# EAGLE schematic m2201-stereo-input (EAGLE 7.5.0)
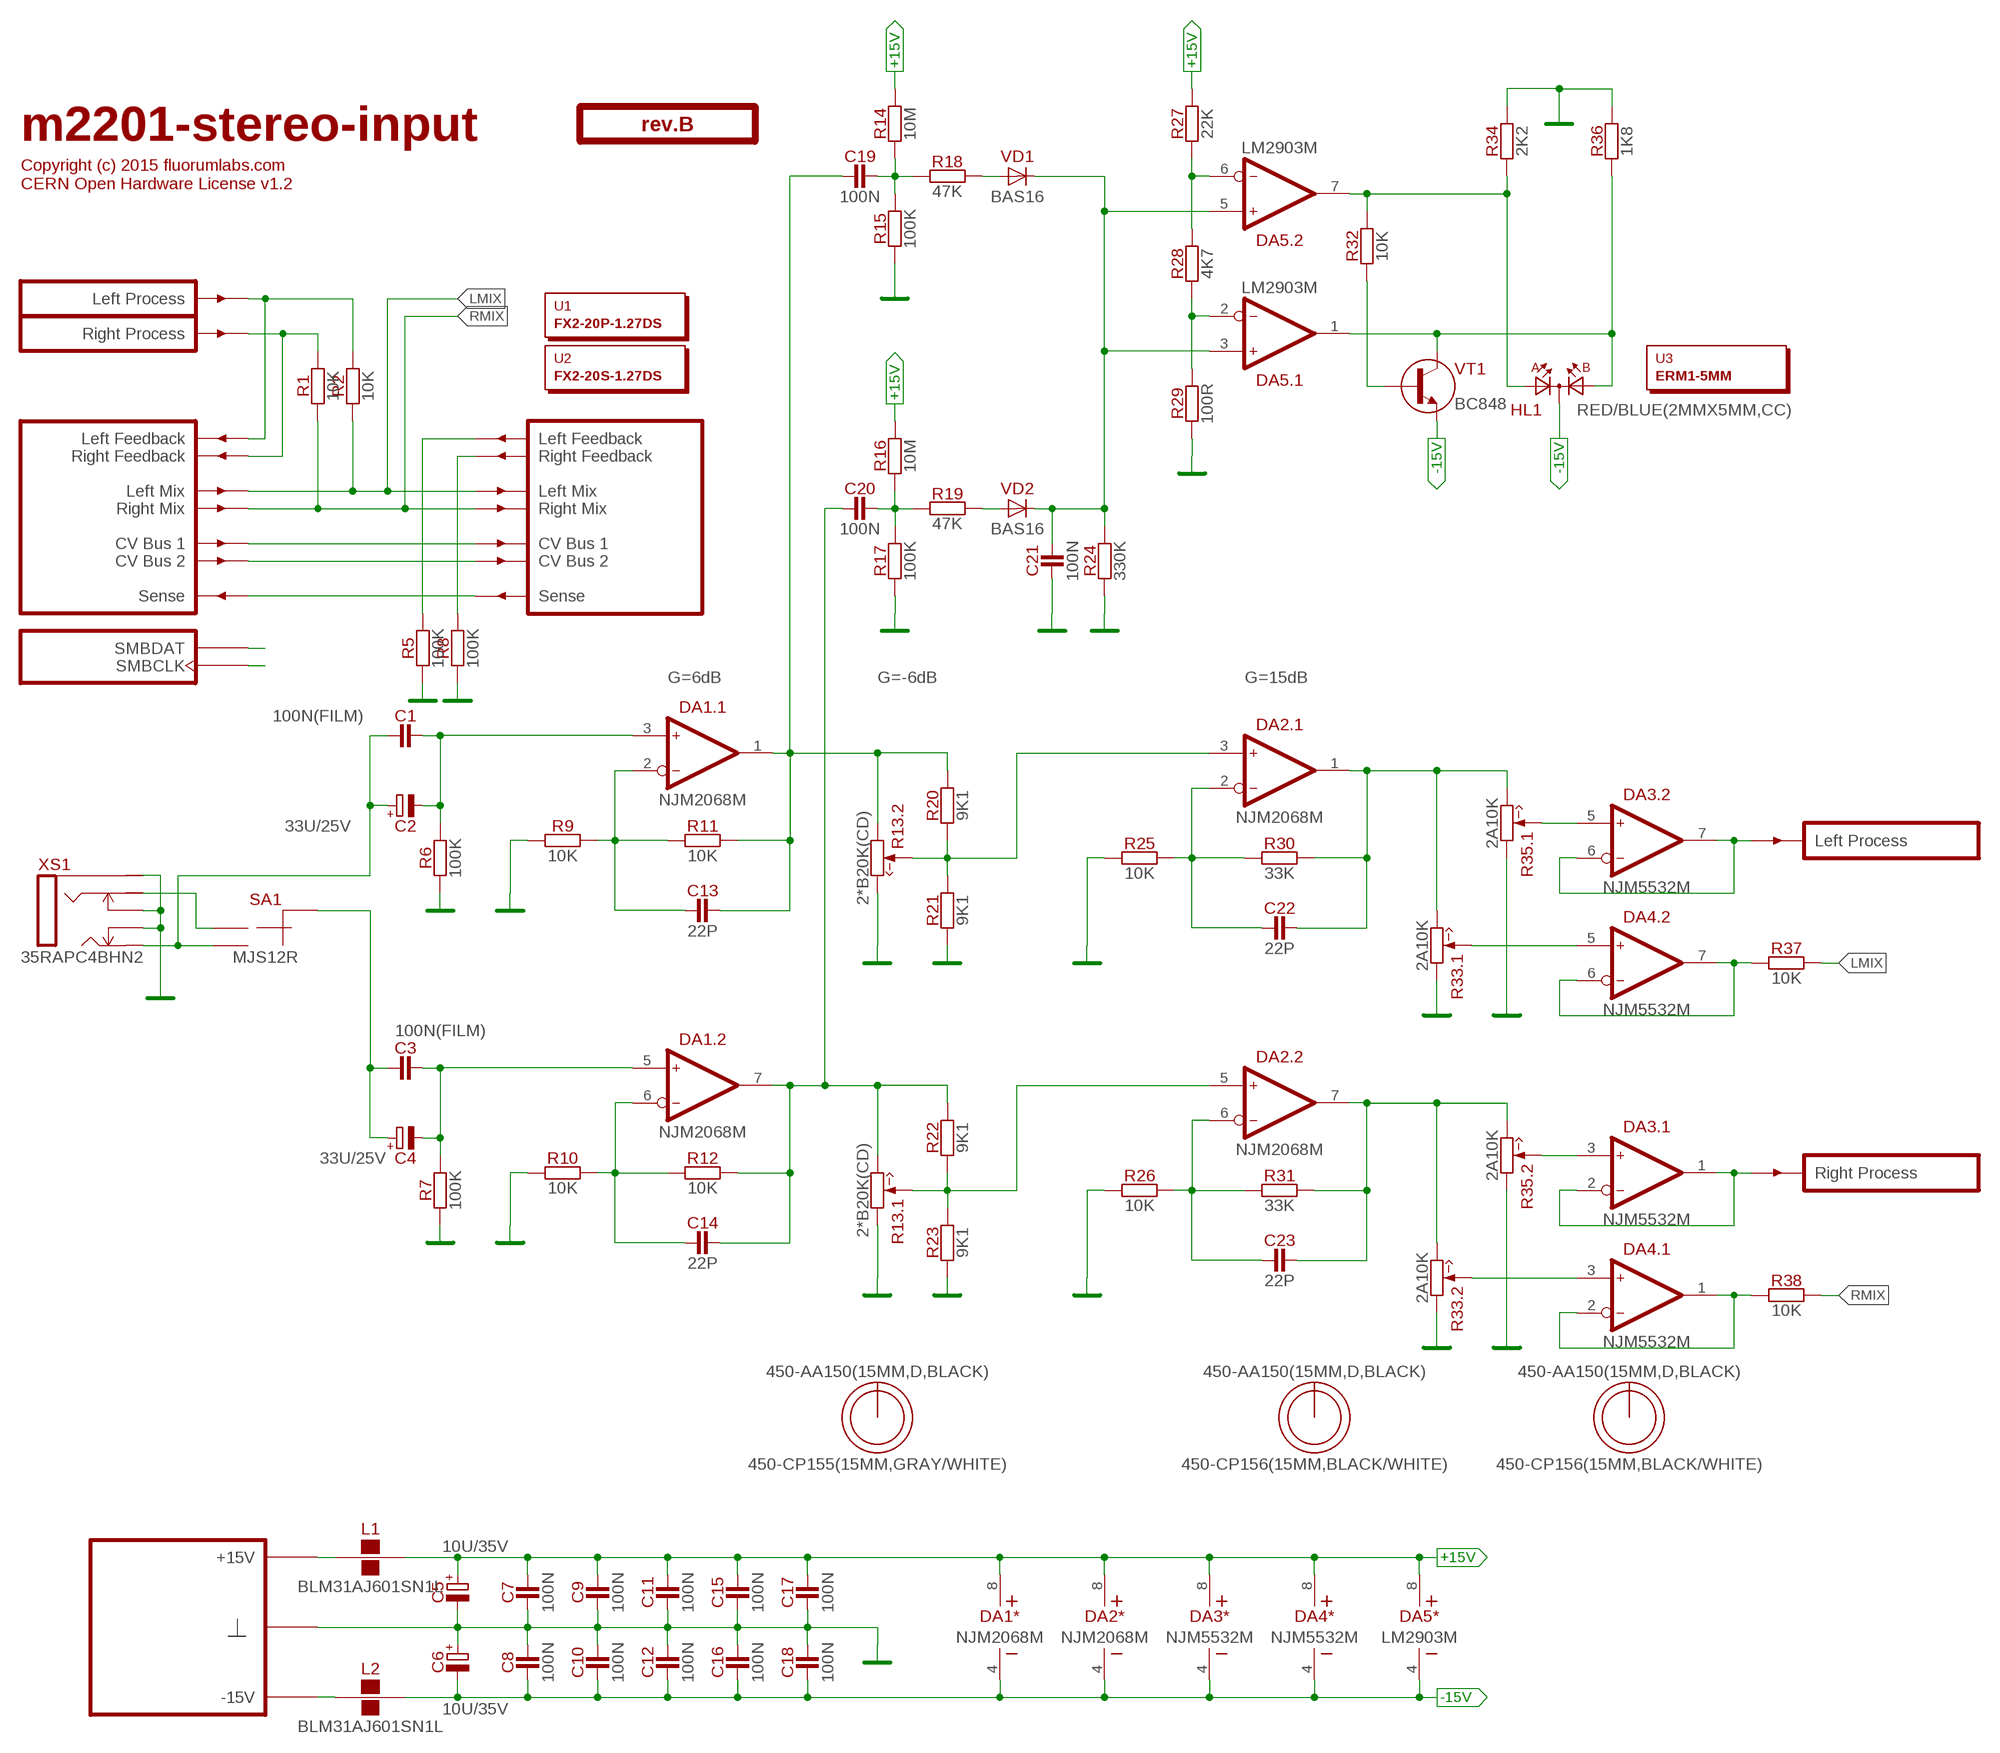
[diagram p0: schematic, sheet 1]

## Parts
C1  100N(FILM)  [C050-025X075]
C2  33U/25V  [E2,5-7]
C3  100N(FILM)  [C050-025X075]
C4  33U/25V  [E2,5-7]
C5  10U/35V  [E2-5]
C6  10U/35V  [E2-5]
C7  100N  [C-0805]
C8  100N  [C-0805]
C9  100N  [C-0805]
C10  100N  [C-0805]
C11  100N  [C-0805]
C12  100N  [C-0805]
C13  22P  [C-0805]
C14  22P  [C-0805]
C15  100N  [C-0805]
C16  100N  [C-0805]
C17  100N  [C-0805]
C18  100N  [C-0805]
C19  100N  [C-0805]
C20  100N  [C-0805]
C21  100N  [C-0805]
C22  22P  [C-0805]
C23  22P  [C-0805]
DA1  NJM2068M  [SO-8]
DA2  NJM2068M  [SO-8]
DA3  NJM5532M  [SO-8]
DA4  NJM5532M  [SO-8]
DA5  LM2903M  [SO-8]
HL1  RED/BLUE(2MMX5MM,CC)  [LED2X5-3PIN]
L1  BLM31AJ601SN1L  [1206]
L2  BLM31AJ601SN1L  [1206]
O1  TITLE  [EMPTY]
O2  450-AA150(15MM,D,BLACK)  [EMPTY]
O3  450-CP155(15MM,GRAY/WHITE)  [EMPTY]
O4  450-AA150(15MM,D,BLACK)  [EMPTY]
O5  450-CP156(15MM,BLACK/WHITE)  [EMPTY]
O6  450-AA150(15MM,D,BLACK)  [EMPTY]
O7  450-CP156(15MM,BLACK/WHITE)  [EMPTY]
PCB1  rev.B  ST2-BOARD-50  [ST2-BOARD-50]
R1  10K  [R-0805]
R2  10K  [R-0805]
R5  100K  [R-0805]
R6  100K  [R-0805]
R7  100K  [R-0805]
R8  100K  [R-0805]
R9  10K  [R-0805]
R10  10K  [R-0805]
R11  10K  [R-0805]
R12  10K  [R-0805]
R13  2*B20K(CD)  2B20K(CD)  [RV11-DUAL]
R14  10M  [R-0805]
R15  100K  [R-0805]
R16  10M  [R-0805]
R17  100K  [R-0805]
R18  47K  [R-0805]
R19  47K  [R-0805]
R20  9K1  [R-0805]
R21  9K1  [R-0805]
R22  9K1  [R-0805]
R23  9K1  [R-0805]
R24  330K  [R-0805]
R25  10K  [R-0805]
R26  10K  [R-0805]
R27  22K  [R-0805]
R28  4K7  [R-0805]
R29  100R  [R-0805]
R30  33K  [R-0805]
R31  33K  [R-0805]
R32  10K  [R-0805]
R33  2A10K  [RV11-DUAL]
R34  2K2  [R-0805]
R35  2A10K  [RV11-DUAL]
R36  1K8  [R-0805]
R37  10K  [R-0805]
R38  10K  [R-0805]
SA1  MJS12R  [APEM-MJS12R]
U1  FX2-20P-1.27DS  [EMPTY]
U2  FX2-20S-1.27DS  [EMPTY]
U3  ERM1-5MM  [EMPTY]
VD1  BAS16  [SOT23]
VD2  BAS16  [SOT23]
VT1  BC848  [SOT23]
XS1  35RAPC4BHN2  [35RAP]

## Nets
+15V [power]: C5.+ C7.2 C9.2 C11.2 C15.2 C17.2 DA1.8(*:V+) DA2.8(*:V+) DA3.8(*:V+) DA4.8(*:V+) DA5.8(*:V+) L1.2 R14.2 R16.2 R27.2
-15V: C6.- C8.1 C10.1 C12.1 C16.1 C18.1 DA1.4(*:V-) DA2.4(*:V-) DA3.4(*:V-) DA4.4(*:V-) DA5.4(*:V-) HL1.K L2.2 VT1.2(E)
GND: C5.- C6.+ C7.1 C8.2 C9.1 C10.2 C11.1 C12.2 C15.1 C16.2 C17.1 C18.2 C21.1 PCB1.B4'(GND) PCB1.B4(GND) PCB1.B5'(GND) PCB1.B5(GND) PCB1.B6'(GND) PCB1.B6(GND) PCB1.B7'(GND) PCB1.B7(GND) PCB1.B8'(GND) PCB1.B8(GND) R5.1 R6.1 R7.1 R8.1 R9.1 R10.1 R13.1(.1:CCW) R13.3'(.2:CW) R15.1 R17.1 R21.1 R23.1 R24.1 R25.1 R26.1 R29.1 R33.1'(.2:CCW) R33.1(.1:CCW) R34.2 R35.1'(.2:CCW) R35.1(.1:CCW) R36.2 XS1.1(S) XS1.10(TN) XS1.11(RN)
LMIX: PCB1.ALMIX'(LMIX') PCB1.ALMIX(LMIX) R2.1 R37.2
N$1: L1.1 PCB1.A+15'(P+15V) PCB1.A+15(P+15V) PCB1.B+15'(P+15V) PCB1.B+15(P+15V)
N$2: PCB1.ARFBK'(RFBK') R8.2
N$3: DA2.3(.1:IN+) R13.2'(.2:W) R20.1 R21.2
N$4: PCB1.ALFBK'(LFBK') R5.2
N$5: L2.1 PCB1.A-15'(P-15V) PCB1.A-15(P-15V) PCB1.B-15'(P-15V) PCB1.B-15(P-15V)
N$6: SA1.NC XS1.3(R)
N$7: C1.1 C2.+ SA1.NO XS1.2(T)
N$8: DA2.5(.2:IN+) R13.2(.1:W) R22.1 R23.2
N$9: C3.2 C4.- DA1.5(.2:IN+) R7.2
N$10: C1.2 C2.- DA1.3(.1:IN+) R6.2
N$11: C23.2 DA2.7(.2:OUT) R31.2 R33.3'(.2:CW) R35.3'(.2:CW)
N$12: C22.2 DA2.1(.1:OUT) R30.2 R33.3(.1:CW) R35.3(.1:CW)
N$13: C22.1 DA2.2(.1:IN-) R25.2 R30.1
N$14: C23.1 DA2.6(.2:IN-) R26.2 R31.1
N$15: C14.2 C20.1 DA1.7(.2:OUT) R12.2 R13.3(.1:CW) R22.2
N$16: PCB1.BSENSE'(SENSE') PCB1.BSENSE(SENSE)
N$17: C19.2 R14.1 R15.2 R18.1
N$18: DA3.6(.2:IN-) DA3.7(.2:OUT) PCB1.BOUTL'(OUTL)
N$19: C13.2 C19.1 DA1.1(.1:OUT) R11.2 R13.1'(.2:CCW) R20.2
N$20: DA4.6(.2:IN-) DA4.7(.2:OUT) R37.1
N$21: DA3.1(.1:OUT) DA3.2(.1:IN-) PCB1.BOUTR'(OUTR)
N$22: DA4.1(.1:OUT) DA4.2(.1:IN-) R38.1
N$23: DA3.5(.2:IN+) R35.2(.1:W)
N$24: DA4.5(.2:IN+) R33.2(.1:W)
N$25: DA3.3(.1:IN+) R35.2'(.2:W)
N$26: C13.1 DA1.2(.1:IN-) R9.2 R11.1
N$27: C14.1 DA1.6(.2:IN-) R10.2 R12.1
N$28: DA4.3(.1:IN+) R33.2'(.2:W)
N$29: R18.2 VD1.1(A)
N$31: C20.2 R16.1 R17.2 R19.1
N$36: C3.1 C4.+ SA1.C(CM)
N$38: PCB1.ASMBDAT'(SMBDAT) PCB1.ASMBDAT(SMBDAT)
N$39: PCB1.ARFBK(RFBK) PCB1.BINR(INR) R1.2
N$40: PCB1.ALFBK(LFBK) PCB1.BINL(INL) R2.2
N$41: PCB1.ACV1'(CV1') PCB1.ACV1(CV1)
N$42: PCB1.ACV2'(CV2') PCB1.ACV2(CV2)
N$43: PCB1.ASMBCLK'(SMBCLK) PCB1.ASMBCLK(SMBCLK)
N$44: R19.2 VD2.1(A)
N$45: C21.2 DA5.3(.1:IN+) DA5.5(.2:IN+) R24.2 VD1.2(C) VD2.2(C)
N$46: DA5.2(.1:IN-) R28.1 R29.2
N$47: DA5.6(.2:IN-) R27.1 R28.2
N$48: DA5.7(.2:OUT) HL1.A1 R32.2 R34.1
N$49: R32.1 VT1.1(B)
N$51: DA5.1(.1:OUT) HL1.A2 R36.1 VT1.3(C)
RMIX: PCB1.ARMIX'(RMIX') PCB1.ARMIX(RMIX) R1.1 R38.2

## Notes on the sheet
- G=6dB | G=-6dB | G=15dB

## Library data of the parts
C1 C3 = capacitors:?; MOUSER: 505-MKS2.1/63/5
C2 C4 = capacitors-electrolytic:?
C5 C6 = capacitors-electrolytic:?; MOUSER: 647-USW1V100MDD
C7-C12 C15-C21 = capacitors:?; MOUSER: 77-VJ0805V104MXBPBC
C13 C14 C22 C23 = capacitors:?; MOUSER: 77-VJ0805A220GXACBC
DA1 DA2 = ic-jrc:NJM2068; MOUSER: 513-NJM2068M
DA3 DA4 = ic-jrc:NJM5532; MOUSER: 513-NJM5532M
DA5 = ic-fairchild:LM2903; MOUSER: 512-LM2903M
HL1 = optoelectronics:?(2MMX5MM,CC)
L1 L2 = inductors:BLM31AJ601SN1L; MOUSER: 81-BLM31AJ601SN1L
O1 = text:TITLE
O2 O4 O6 = hardware:450-AA?; MOUSER: 450-AA150
O3 = hardware:450-C?; MOUSER: 450-CP155
O5 O7 = hardware:450-C?; MOUSER: 450-CP156
PCB1 = module-footprints:ST2-BOARD-50
R1 R2 R9-R12 R25 R26 R32 R37 R38 = resistors:?; MOUSER: 660-RK73H2ATTD1002F
R5-R8 R15 R17 = resistors:?; MOUSER: 660-RK73H2ATTD1003F
R13 = potentiometers:2**?; MOUSER: 688-RK12L1230C1M
R14 R16 = resistors:?; MOUSER: 660-RK73H2ATTD1005F
R18 R19 = resistors:?; MOUSER: 660-RK73H2ATTD4702F
R20-R23 = resistors:?; MOUSER: 660-RK73H2ATTD9101F
R24 = resistors:?; MOUSER: 660-RK73H2ATTD3303F
R27 = resistors:?; MOUSER: 660-RK73H2ATTD2202F
R28 = resistors:?; MOUSER: 660-RK73H2ATTD4701F
R29 = resistors:?; MOUSER: 660-RK73H2ATTD1000F
R30 R31 = resistors:?; MOUSER: 660-RK73H2ATTD3302F
R33 R35 = potentiometers:2**?; MOUSER: 688-RK12L12C0A0E
R34 = resistors:?; MOUSER: 660-RK73H2ATTD2201F
R36 = resistors:?; MOUSER: 660-RK73H2ATTD1801F
SA1 = switches:MJS12R; MOUSER: 642-MJS12R
U1 = hardware:?; MOUSER: 798-FX2-20P-1.27DS71
U2 = hardware:?; MOUSER: 798-FX2-20S-1.27DS71
U3 = hardware:?
VD1 VD2 = diodes:?; MOUSER: 863-BAS16LT3G
VT1 = transistors-npn:?; MOUSER: 863-BC848BLT3G
XS1 = connectors:35RAPC4BHN2; MOUSER: 502-35RAPC4BHN2